# EasyEDA schematic SCH_lora_picobaloon_2023-04-08.json
TITLE: Tracker_sch; REV: 1.0; Date: 2022-07-02; Sheet: 1/1; Company: Your Company
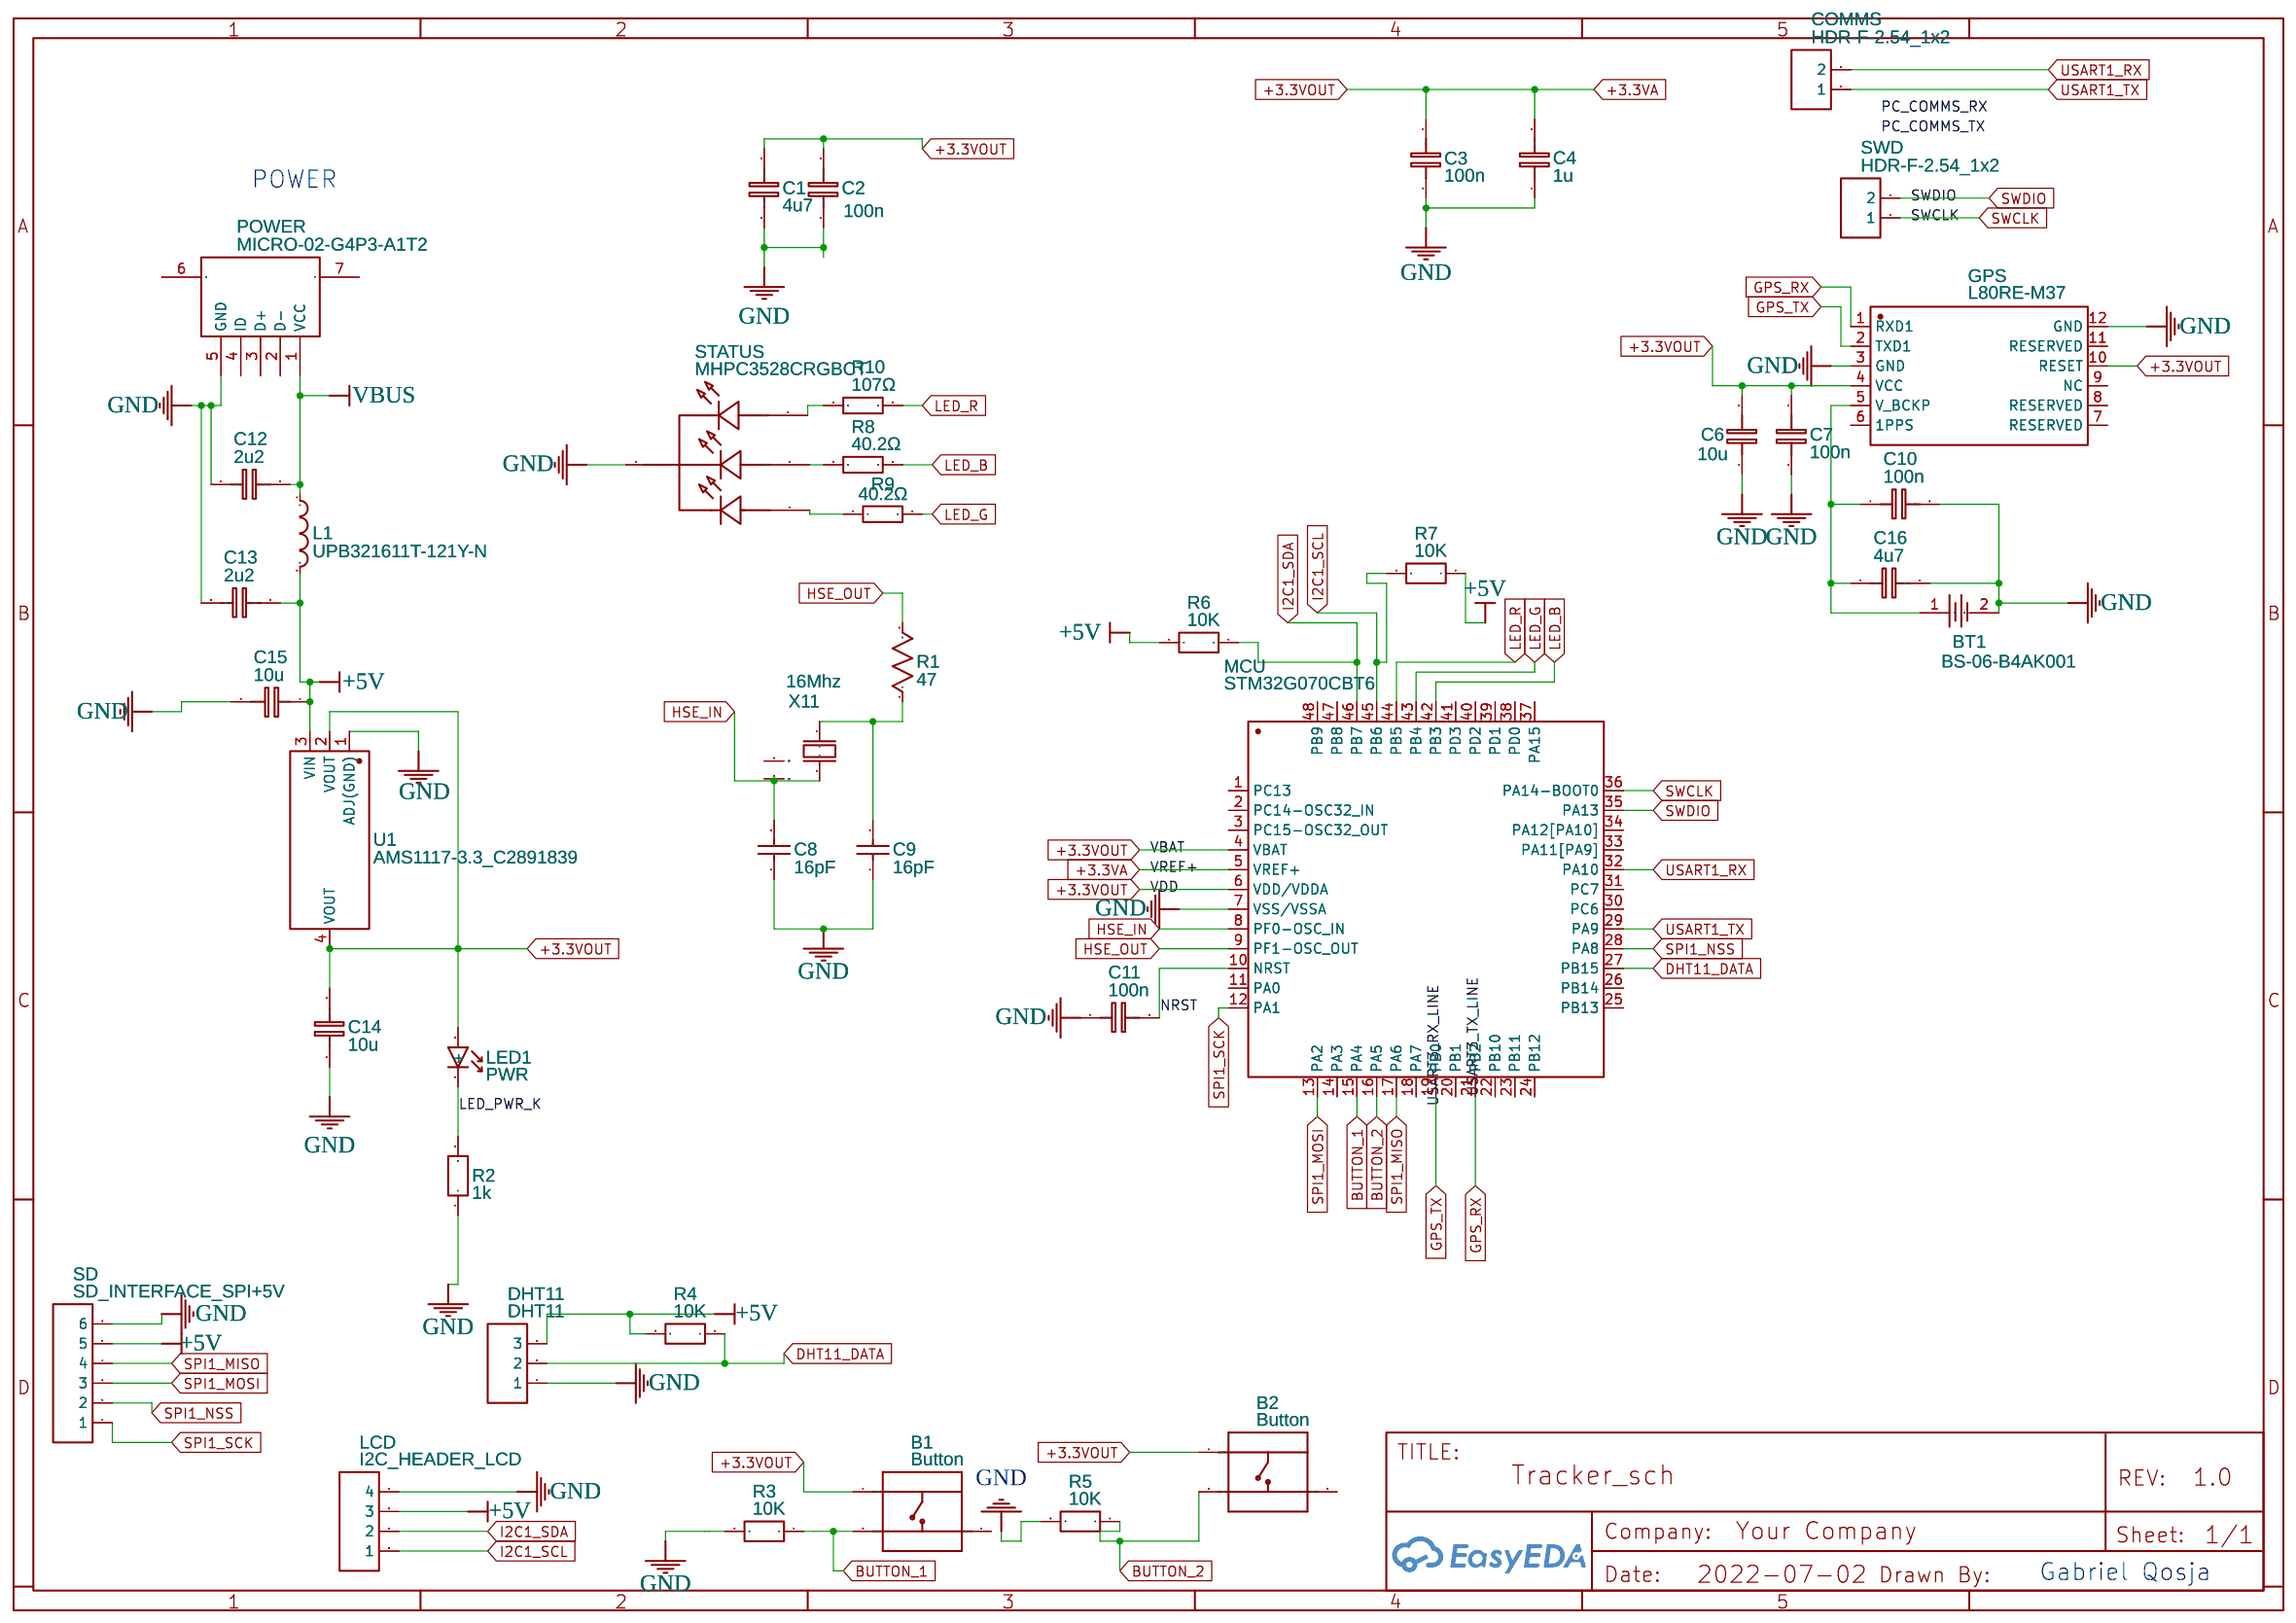
[diagram p0: schematic sheet]

## Parts
B1  Button  [THROUGH-HOLE BUTTON]
B2  Button  [THROUGH-HOLE BUTTON]
BT1  BS-06-B4AK001  [BAT-SMD_BS-06-B4AA012]
C1  4u7  [C0603]
C2  100n  [C0603]
C3  100n  [C0603]
C4  1u  [C0603]
C6  10u  [C0603]
C7  100n  [C0603]
C8  16pF  [C0603]
C9  16pF  [C0603]
C10  100n  [C0603]
C11  100n  [C0603]
C12  2u2  [C0603]
C13  2u2  [C0603]
C14  10u  [C0603]
C15  10u  [C0603]
C16  4u7  [C0603]
COMMS  HDR-F-2.54_1x2  [HDR-F-2.54_1X2]
DHT11  DHT11  [HDR-F-2.54_1X3]
GPS  L80RE-M37  [GPSM-SMD_12P-L16.0-W16.0-P2.54-BL]
L1  UPB321611T-121Y-N  [L1206]
LCD  I2C_HEADER_LCD  [HDR-F-2.54_1X4]
LED1  PWR  [LED-3MM-2.54MM-THROUGH HOLE]
MCU  STM32G070CBT6  [LQFP-48_L7.0-W7.0-P0.50-LS9.0-BL]
POWER  MICRO-02-G4P3-A1T2  [MICRO-USB-SMD_MICRO-02-GXPX-A1T2]
R1  47  [R0603]
R2  1k  [R0603]
R3  10K  [R0603]
R4  10K  [R0603]
R5  10K  [R0603]
R6  10K  [R0603]
R7  10K  [R0603]
R8  40.2Ω  [R0603]
R9  40.2Ω  [R0603]
R10  107Ω  [R0805]
SD  SD_INTERFACE_SPI+5V  [HDR-F-2.54_1X6]
STATUS  MHPC3528CRGBCT  [LED-SMD_4P-L3.2-W2.8-BL]
SWD  HDR-F-2.54_1x2  [HDR-F-2.54_1X2]
U1  AMS1117-3.3_C2891839  [SOT-223-3_L6.5-W3.4-P2.30-LS7.0-BR]
X11  16Mhz  [BT-XTAL_2520]

## Library data of the parts
B1 B2 = Button: Contributor: andres_c
BT1 = BS-06-B4AK001: Supplier: LCSC; Supplier Part: C964760; Manufacturer: MYOUNG(美阳); Contributor: LCSC; JLCPCB Part Class: Extended Part
C1 C16 = C_0603_EU: Supplier Part: C69335; Supplier: LCSC; Contributor: LCEDA_Lib; Manufacturer Part: CL10A475KA8NQNC; Manufacturer: SAMSUNG
C2 C3 C7 C10 C11 = C_0603_EU: Supplier Part: C1591; Supplier: LCSC; Contributor: LCEDA_Lib; Manufacturer Part: CL10B104KB8NNNC; Manufacturer: SAMSUNG
C4 = C_0603_EU: Supplier Part: C5673; Supplier: LCSC; Contributor: LCEDA_Lib; Manufacturer Part: CL10A105KA8NNNC; Manufacturer: SAMSUNG
C6 C14 C15 = C_0603_EU: Supplier Part: C96446; Supplier: LCSC; Contributor: LCEDA_Lib; Manufacturer Part: CL10A106MA8NRNC; Manufacturer: SAMSUNG
C8 C9 = 0603CG160J500NT: Supplier: LCSC; Manufacturer Part: CL10C160JB8NNNC; Manufacturer: Samsung Electro-Mechanics; Supplier Part: C170135; JLCPCB Part Class: Extended Part
C12 C13 = C_0603_EU: Supplier Part: C913904; Supplier: LCSC; Contributor: LCEDA_Lib; Manufacturer Part: CL10A225KB8NNNC; Manufacturer: SAMSUNG(三星)
COMMS SWD = HDR-F-2.54_1x2: Supplier Part: C49661; Supplier: LCSC; Contributor: LCEDA_Lib
DHT11 = HDR-F-2.54_1x3: Supplier Part: C146690; Supplier: LCSC; Contributor: LCEDA_Lib
GPS = L80RE-M37: Supplier: LCSC; Supplier Part: C3029061; Manufacturer: 移远 Quectel; link: https://atta.szlcsc.com/upload/public/pdf/source/20220527/3A05E11B37A3891E2217B4B1159372B8.pdf; JLCPCB Part Class: Extended Part; Contributor: lcsc
L1 = UPB321611T-121Y-N: Supplier: LCSC; Supplier Part: C280703; Manufacturer: Chilisin Elec; Contributor: LCSC; JLCPCB Part Class: Extended Part
LCD = HDR-F-2.54_1x4: Supplier Part: C225501; Supplier: LCSC; Contributor: LCEDA_Lib
LED1 = LED THROUGH HOLE - SIMPLE: Supplier: Mouser; Contributor: victorbramhall
MCU = STM32G070CBT6: Supplier: LCSC; Supplier Part: C529338; Manufacturer: STMicroelectronics; Contributor: LCSC; JLCPCB Part Class: Extended Part
POWER = MICRO-02-G4P3-A1T2: Supplier: LCSC; Supplier Part: C2682527; Manufacturer: Yuandi; Contributor: LCSC; JLCPCB Part Class: Extended Part
R1 = R_0603_US: Supplier Part: C326724; Supplier: LCSC; Contributor: LCEDA_Lib; Manufacturer Part: RT0603BRD0747RL; Manufacturer: YAGEO
R2 = R_0603_EU: Supplier Part: C304098; Supplier: LCSC; Contributor: LCEDA_Lib; Manufacturer Part: AR03FTDX1001; Manufacturer: Viking Tech
R3-R7 = R_0603_EU: Supplier Part: C136139; Supplier: LCSC; Contributor: LCEDA_Lib; Manufacturer Part: RT0603BRE0710KL; Manufacturer: YAGEO
R8 R9 = MCR03EZPFX40R2: Supplier: LCSC; Supplier Part: C308259; Manufacturer: ROHM Semicon; Resistance (Ohms): 40.2; Contributor: LCSC; JLCPCB Part Class: Extended Part
R10 = RS-05K1070FT: Supplier: LCSC; Supplier Part: C322239; Manufacturer: Guangdong Fenghua Advanced Tech; Resistance (Ohms): 107; Contributor: LCSC; JLCPCB Part Class: Extended Part
SD = HDR-F-2.54_1x6: Supplier Part: C40877; Supplier: LCSC; Contributor: LCEDA_Lib
STATUS = MHPC3528CRGBCT: Supplier: LCSC; Supplier Part: C2962096; Manufacturer: MEIHUA(美华科技); Contributor: lcsc
U1 = AMS1117-3.3_C2891839: Supplier: LCSC; Supplier Part: C2891839; Manufacturer: YONGYUTAI(永裕泰); Manufacturer Part: AMS1117-3.3; Contributor: LCSC; JLCPCB Part Class: Extended Part
X11 = XTAL_4-pin_grounded: Manufacturer: Suzhou Liming Elec; Manufacturer Part: 3225-16.00-12-10-10/A; Contributor: Alex Wilson; Supplier: LCSC; Supplier Part: C518161

## Nets
+3.3VA: B1.1(A0) B2.1(A0) C1.2 C2.2 C3.2 C4.2 C6.2 C7.2 C14.2 GPS.4(VCC) GPS.10(RESET) LED1.1(+) MCU.4(VBAT) MCU.5(VREF+) MCU.6(VDD/VDDA) U1.2(VOUT) U1.4(VOUT)
+5V: C13.2 C15.1 DHT11.3 L1.2 LCD.3 R4.2 R6.2 R7.1 SD.5 U1.3(VIN)
GND: BT1.2 C1.1 C2.1 C3.1 C4.1 C6.1 C7.1 C8.1 C9.1 C10.2 C11.1 C12.1 C13.1 C14.1 C15.2 C16.2 DHT11.1 GPS.3(GND) GPS.12(GND) LCD.4 MCU.7(VSS/VSSA) POWER.5(GND) R2.1 R3.2 R5.2 SD.6 STATUS.4(-) U1.1(ADJ(GND))
VBUS: C12.2 L1.1 POWER.1(VCC)
BUTTON_1: B1.2(B0) MCU.15(PA4) R3.1
BUTTON_2: B2.2(B0) MCU.16(PA5) R5.1
DHT11_DATA: DHT11.2 MCU.27(PB15) R4.1
GPS_RX: GPS.1(RXD1) MCU.21(PB2)
GPS_TX: GPS.2(TXD1) MCU.19(PB0)
HSE_IN: C8.2 MCU.8(PF0-OSC_IN) X11.3(out)
HSE_OUT: MCU.9(PF1-OSC_OUT) R1.2
I2C1_SCL: LCD.1 MCU.45(PB6) R7.2
I2C1_SDA: LCD.2 MCU.46(PB7) R6.1
LED_B: MCU.42(PB3) R8.2
LED_G: MCU.43(PB4) R9.2
LED_PWR_K: LED1.2(-) R2.2
LED_R: MCU.44(PB5) R10.2
NRST: C11.2 MCU.10(NRST)
SPI1_MISO: MCU.17(PA6) SD.4
SPI1_MOSI: MCU.13(PA2) SD.3
SPI1_NSS: MCU.28(PA8) SD.2
SPI1_SCK: MCU.12(PA1) SD.1
SWCLK: MCU.36(PA14-BOOT0) SWD.1
SWDIO: MCU.35(PA13) SWD.2
USART1_RX: COMMS.2 MCU.32(PA10)
USART1_TX: COMMS.1 MCU.29(PA9)
Net-(BT1-1): BT1.1 C10.1 C16.1 GPS.5(V_BCKP)
Net-(C9-2): C9.2 R1.1 X11.1(inp)
Net-(R8-1): R8.1 STATUS.2(+)
Net-(R9-1): R9.1 STATUS.3(+)
Net-(R10-1): R10.1 STATUS.1(+)

Not connected (* = marked no-connect by the designer): B1 3(B1); B2 3(B1); GPS 6(1PPS) 7(RESERVED) 8(RESERVED) 9(NC) 11(RESERVED); MCU 1(PC13) 2(PC14-OSC32_IN) 3(PC15-OSC32_OUT) 11(PA0) 14(PA3) 18(PA7) 20(PB1) 22(PB10) 23(PB11) 24(PB12) 25(PB13) 26(PB14) 30(PC6) 31(PC7) 33(PA11[PA9]) 34(PA12[PA10]) 37(PA15) 38(PD0) 39(PD1) 40(PD2) 41(PD3) 47(PB8) 48(PB9); POWER 2(D-) 3(D+) 4(ID) 6 7; X11 2(GND) 4(GND)

## Notes on the sheet
- POWER
- Gabriel Qosja
